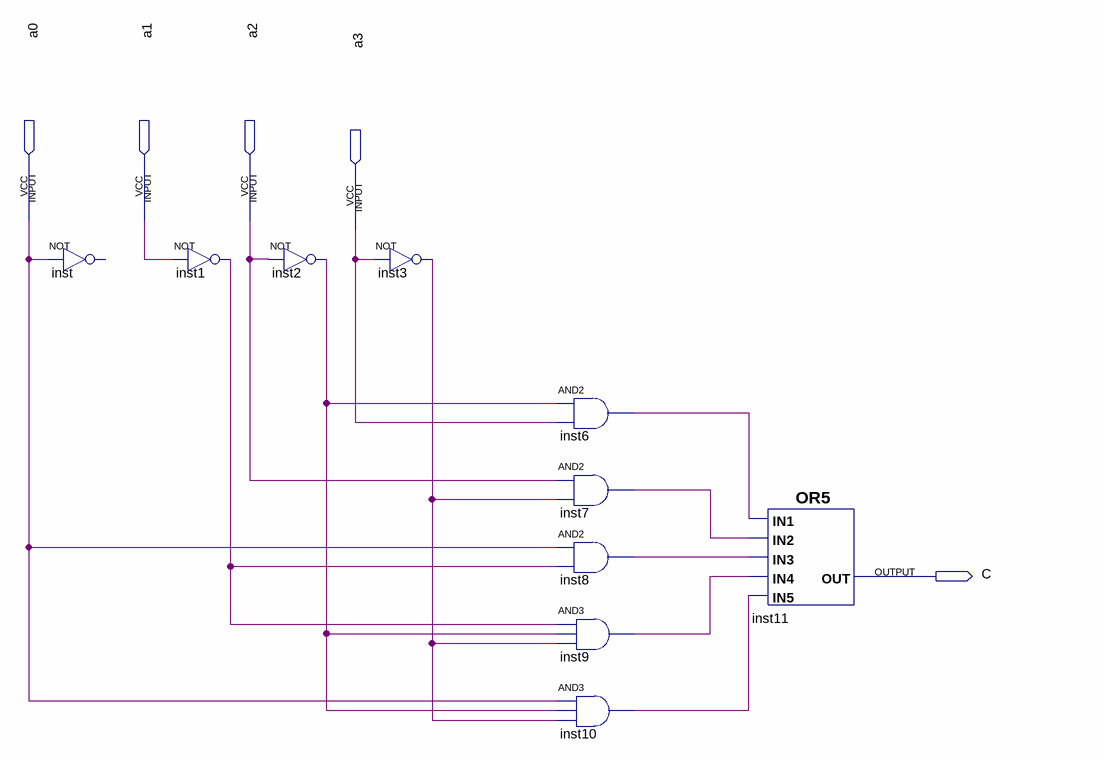
[diagram p0: schematic sheet]
// Quartus schematic C.bdf as structural Verilog: 10 symbols, 5 pins
module C (
  input  a0,
  input  a1,
  input  a2,
  input  a3,
  output C
);

  wire inst1_out, inst2_out, inst3_out, inst6_out, inst7_out, inst8_out, inst9_out, inst10_out;

  // NOT inst has open pins: IN=a0, OUT=open
  not inst1 (inst1_out, a1);
  not inst2 (inst2_out, a2);
  not inst3 (inst3_out, a3);
  and inst6 (inst6_out, inst2_out, a3);
  and inst7 (inst7_out, a2, inst3_out);
  and inst8 (inst8_out, a0, inst1_out);
  and inst9 (inst9_out, inst1_out, inst2_out, inst3_out);
  and inst10 (inst10_out, a0, inst2_out, inst3_out);
  or inst11 (C, inst6_out, inst7_out, inst8_out, inst9_out, inst10_out);
endmodule
